# Altium project ife19_TS_Charger.PrjPCB
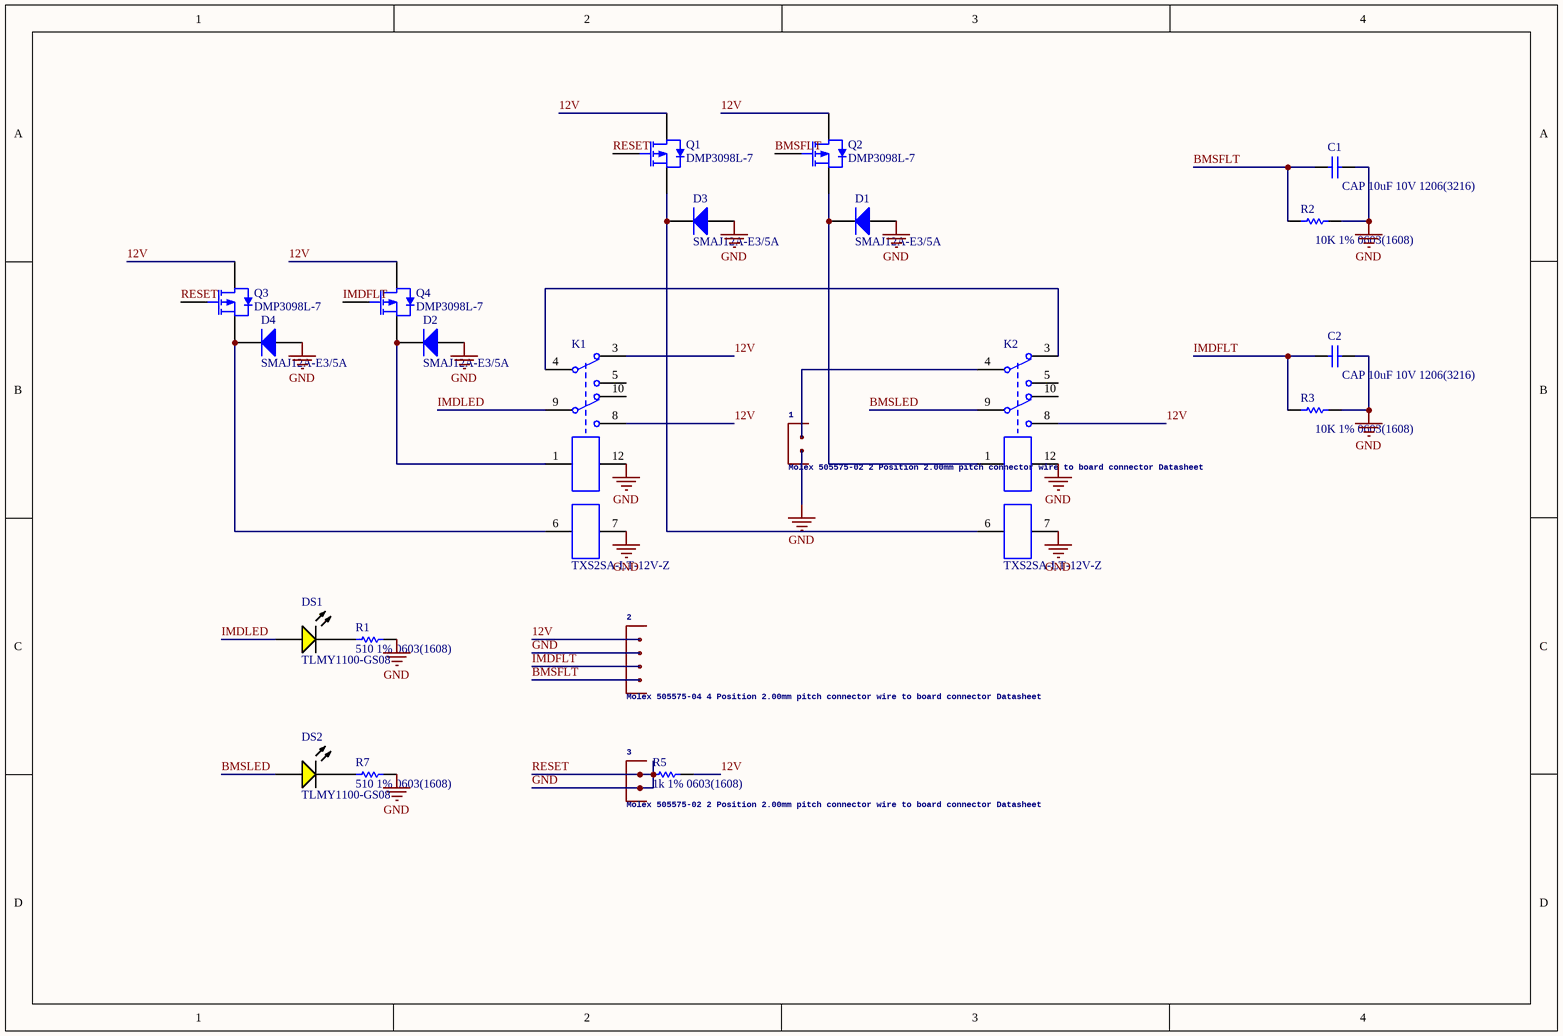
[diagram p0: ife19_TS_Charger.SchDoc]
1 sheet, 22 parts. Net scope: global (net labels, ports and power ports of the same name join across sheets).
Board file: ife19_TS_Charger.PcbDoc

## Sheet ife19_TS_Charger.SchDoc
size A4

### Parts
1  Molex 505575-02 2 Position 2.00mm pitch connector wire to board connector Datasheet  [505575-02]
2  Molex 505575-04 4 Position 2.00mm pitch connector wire to board connector Datasheet  [505575-04]
3  Molex 505575-02 2 Position 2.00mm pitch connector wire to board connector Datasheet  [505575-02]
C1  CAP 10uF 10V 1206(3216)  [CAPC1206(3216)130_L]
C2  CAP 10uF 10V 1206(3216)  [CAPC1206(3216)130_L]
D1  SMAJ12A-E3/5A  [VISH-DO-214AC-2_M]
D2  SMAJ12A-E3/5A  [VISH-DO-214AC-2_M]
D3  SMAJ12A-E3/5A  [VISH-DO-214AC-2_M]
D4  SMAJ12A-E3/5A  [VISH-DO-214AC-2_M]
DS1  TLMY1100-GS08  [VISH-TLMX1100-2_V]
DS2  TLMY1100-GS08  [VISH-TLMX1100-2_V]
K1  TXS2SA-LT-12V-Z  [PNSC-TXS2SA-L2_V]
K2  TXS2SA-LT-12V-Z  [PNSC-TXS2SA-L2_V]
Q1  DMP3098L-7  [DIOD-SOT23-3_V]
Q2  DMP3098L-7  [DIOD-SOT23-3_V]
Q3  DMP3098L-7  [DIOD-SOT23-3_V]
Q4  DMP3098L-7  [DIOD-SOT23-3_V]
R1  510 1% 0603(1608)  [RESC0603(1608)_L]
R2  10K 1% 0603(1608)  [RESC0603(1608)_L]
R3  10K 1% 0603(1608)  [RESC0603(1608)_L]
R5  1k 1% 0603(1608)  [RESC0603(1608)_L]
R7  510 1% 0603(1608)  [RESC0603(1608)_L]

### Nets
GND: 1.2 2.2 3.1 3.2 C1.2 C2.2 D1.2(A) D2.2(A) D3.2(A) D4.2(A) K1.7 K1.12 K2.7 K2.12 Q1.1(G) Q3.1(G) R1.1 R2.1 R3.1 R5.2 R7.1  [also labelled RESET]
12V: 2.1 K1.3 K1.8 K2.8 Q1.3(D) Q2.3(D) Q3.3(D) Q4.3(D) R5.1
BMSFLT: 2.4 C1.1 Q2.1(G) R2.2
BMSLED: DS2.1(A) K2.9
IMDFLT: 2.3 C2.1 Q4.1(G) R3.2
IMDLED: DS1.1(A) K1.9
Net1_1: 1.1 K2.4
NetD1_1: D1.1(K) K2.1 Q2.2(S)
NetD2_1: D2.1(K) K1.1 Q4.2(S)
NetD3_1: D3.1(K) K2.6 Q1.2(S)
NetD4_1: D4.1(K) K1.6 Q3.2(S)
NetDS1_2: DS1.2(K) R1.2
NetDS2_2: DS2.2(K) R7.2
NetK1_4: K1.4 K2.3

Not connected (* = marked no-connect by the designer): K1 5 10; K2 5 10

### Library data of the parts
1 3 = 505575-02: GateName_1: G$1; SymbolName_1: 2POS; LibraryName: MOLEX Micro-Lock; DeviceSetName: 505575-02; Package: 505575-02
2 = 505575-04: GateName_1: G$1; SymbolName_1: 4POS; LibraryName: MOLEX Micro-Lock; DeviceSetName: 505575-04; Package: 505575-04
C1 C2 = CMP-1037-04970-1: CAP 10uF 10V -20% to +80% 1206 (3216 Metric) Thickness 1.3mm SMD; Case-Metric: 3216; Case-EIA: 1206; Value: 10uF; Rated Voltage: 10 V; Technology: SMT; Max Thickness: 1.3 mm; Tolerance: -20% to +80%
D1-D4 = CMP-0548-00315-2: Transient Voltage Suppressor, 6.40 to 231 V, 12 V Stand-off Voltage, Uni-Directional, -55 to 155 degC, 2-pin DO-214AC, Pb-Free, Tape and Reel; Manufacturer: Vishay Semiconductor; IFSM: 40 A; ID (uA): 1; VBR Uni-Directional (V): 6.4 to 231; PPPM (W): 400, 300; VWM (V): 12; PartNumber: SMAJ12A-E3/5A; ComponentLink2URL: http://www.vishay.com/docs/88390/smaj50a.pdf; Packing: Tape and Reel; DatasheetVersion: 12/8/2013; Operating Junction and Storage Temperature Range: -55 to 150 degC; Mounting Technology: Surface Mount; PackageDescription: 2-Pin DO-214AC (SMA), Body 4.245 x 2.665 mm; ComponentLink1URL: http://www.vishay.com/; ComponentLink3Description: Package Specification; PackageReference: DO-214AC-2; ComponentLink1Description: Manufacturer URL; ComponentLink2Description: Datasheet; RoHS: TRUE; ComponentLink3URL: http://www.vishay.com/docs/88390/smaj50a.pdf
DS1 DS2 = CMP-1666-00030-1: Yellow LED, 20 mA, 2.1 V, -40 to 100 degC, 2-Pin SMD (0603), RoHS, Tape and Reel; ComponentLink2Description: Datasheet; ComponentLink2URL: http://download.siliconexpert.com/pdfs/2016/8/7/12/43/26/667/vsh_/manual/379263299541529tlmb1100.pdf; ComponentLink1Description: Manufacturer URL; PackageDescription: 2-Pin Surface Mount Device, Body 1.6 x 0.8 mm; DatasheetVersion: Rev. 2.7, 03/2016; ComponentLink1URL: http://www.vishay.com/; PackageReference: 0603
K1 K2 = CMP-2000-07338-1: Very High Sensitivity, Relay, 70 mW, 3 V, 10-Pin SMD, RoHS, Tape and Reel; Manufacturer: Panasonic; Operate Time: 5ms; Switching Voltage: 110VDC-Max; Contact Rating (Current): 1A; Turn On Voltage (Max): 2.4VDC; Other Names: 255-2347-2 / TXS2SA-L2-3V-Z-ND; Coil Resistance: 129Ohms; Coil Power: 70mW; Relay Type: GeneralPurpose; Dynamic Catalog: TX-SSeries; Coil Type: Latching,DualCoil; Contact Form: DPDT(2FormC); Coil Voltage: 3VDC; Catalog Drawings: TX,TXSSeriesSMD / TX,TXSSeriesCircuitL2; Other Related Documents: RelayTechnicalInfo / StandardsChart / HowtoReadDateCodes; Coil Current: 23.3mA; Features: Sealed-Fully; Category: Relays; Mounting Type: SurfaceMount; Family: SignalRelays,Upto2Amps; Release Time: 5ms; Contact Material: Silver(Ag),Gold(Au); Operating Temperature: -40°C~70°C; Datasheet Version: 02/2014; Mounting Technology: SurfaceMount; Manufacturer URL: http://www.panasonic.com/; Standard Package: 500; Datasheet URL: http://www.panasonic-electric-works.com/eu-asset/en/downloads/ds_61022_en_txs.pdf; Series: TX-S; Packaging: Tape&Reel(TR); Termination Style: GullWing; Package Description: 10-Pin Surface Mount Device, Body 15 x 7.4 mm, Pitch 2.54 mm; Package Reference: TXS2SA-L2
Q1-Q4 = CMP-0697-00001-2: P-Channel Enhancement Mode MOSFET, -30 V VDS, -55 to 155 degC, 3-Pin SOT23, RoHS, Tape and Reel; Manufacturer: Diodes Inc; PD (TA: 25 degC)=1.08 W; VGS: +/- 20 V; VDS: -30 V; IDS (TA: 25 degC)=-3.8 A; RDS(on) (Max.) (VGS: 4.5 V)=120 mOhm; VGS(th) (Max.): -2.1 V; ComponentLink3Description: Package Specification; ComponentLink3URL: http://www.diodes.com/datasheets/ap02002.pdf; PackageDescription: 3-Pin Small Outline Transistor, Body 1.3 x 2.9 mm, Pitch 0.95 mm; PackageReference: SOT23; PartNumber: DMP3098L-7; ComponentLink1Description: Manufacturer URL; ComponentLink2Description: Datasheet; ComponentLink2URL: http://www.diodes.com/datasheets/ds31447.pdf; ComponentLink1URL: http://www.diodes.com/; DatasheetVersion: Rev. 8 - 2; Mounting Technology: Surface Mount; RoHS: TRUE; Packing: Tape and Reel; PackageVersion: Rev. 75; Operating Temperature Range: -55 to 150 degC
R1-R3 R5 R7 = CMP-1012-00779-1: 249K 0.1W 1% 0603 (1608 Metric)  SMD; Case-Metric: 1608; Case-EIA: 0603; Value: 249000.00 Ohm; Technology: SMT; Power: 0.1 W; Tolerance: 1 %